# Altium project HAB_V01R01.PrjPCB (part 1 of 2)
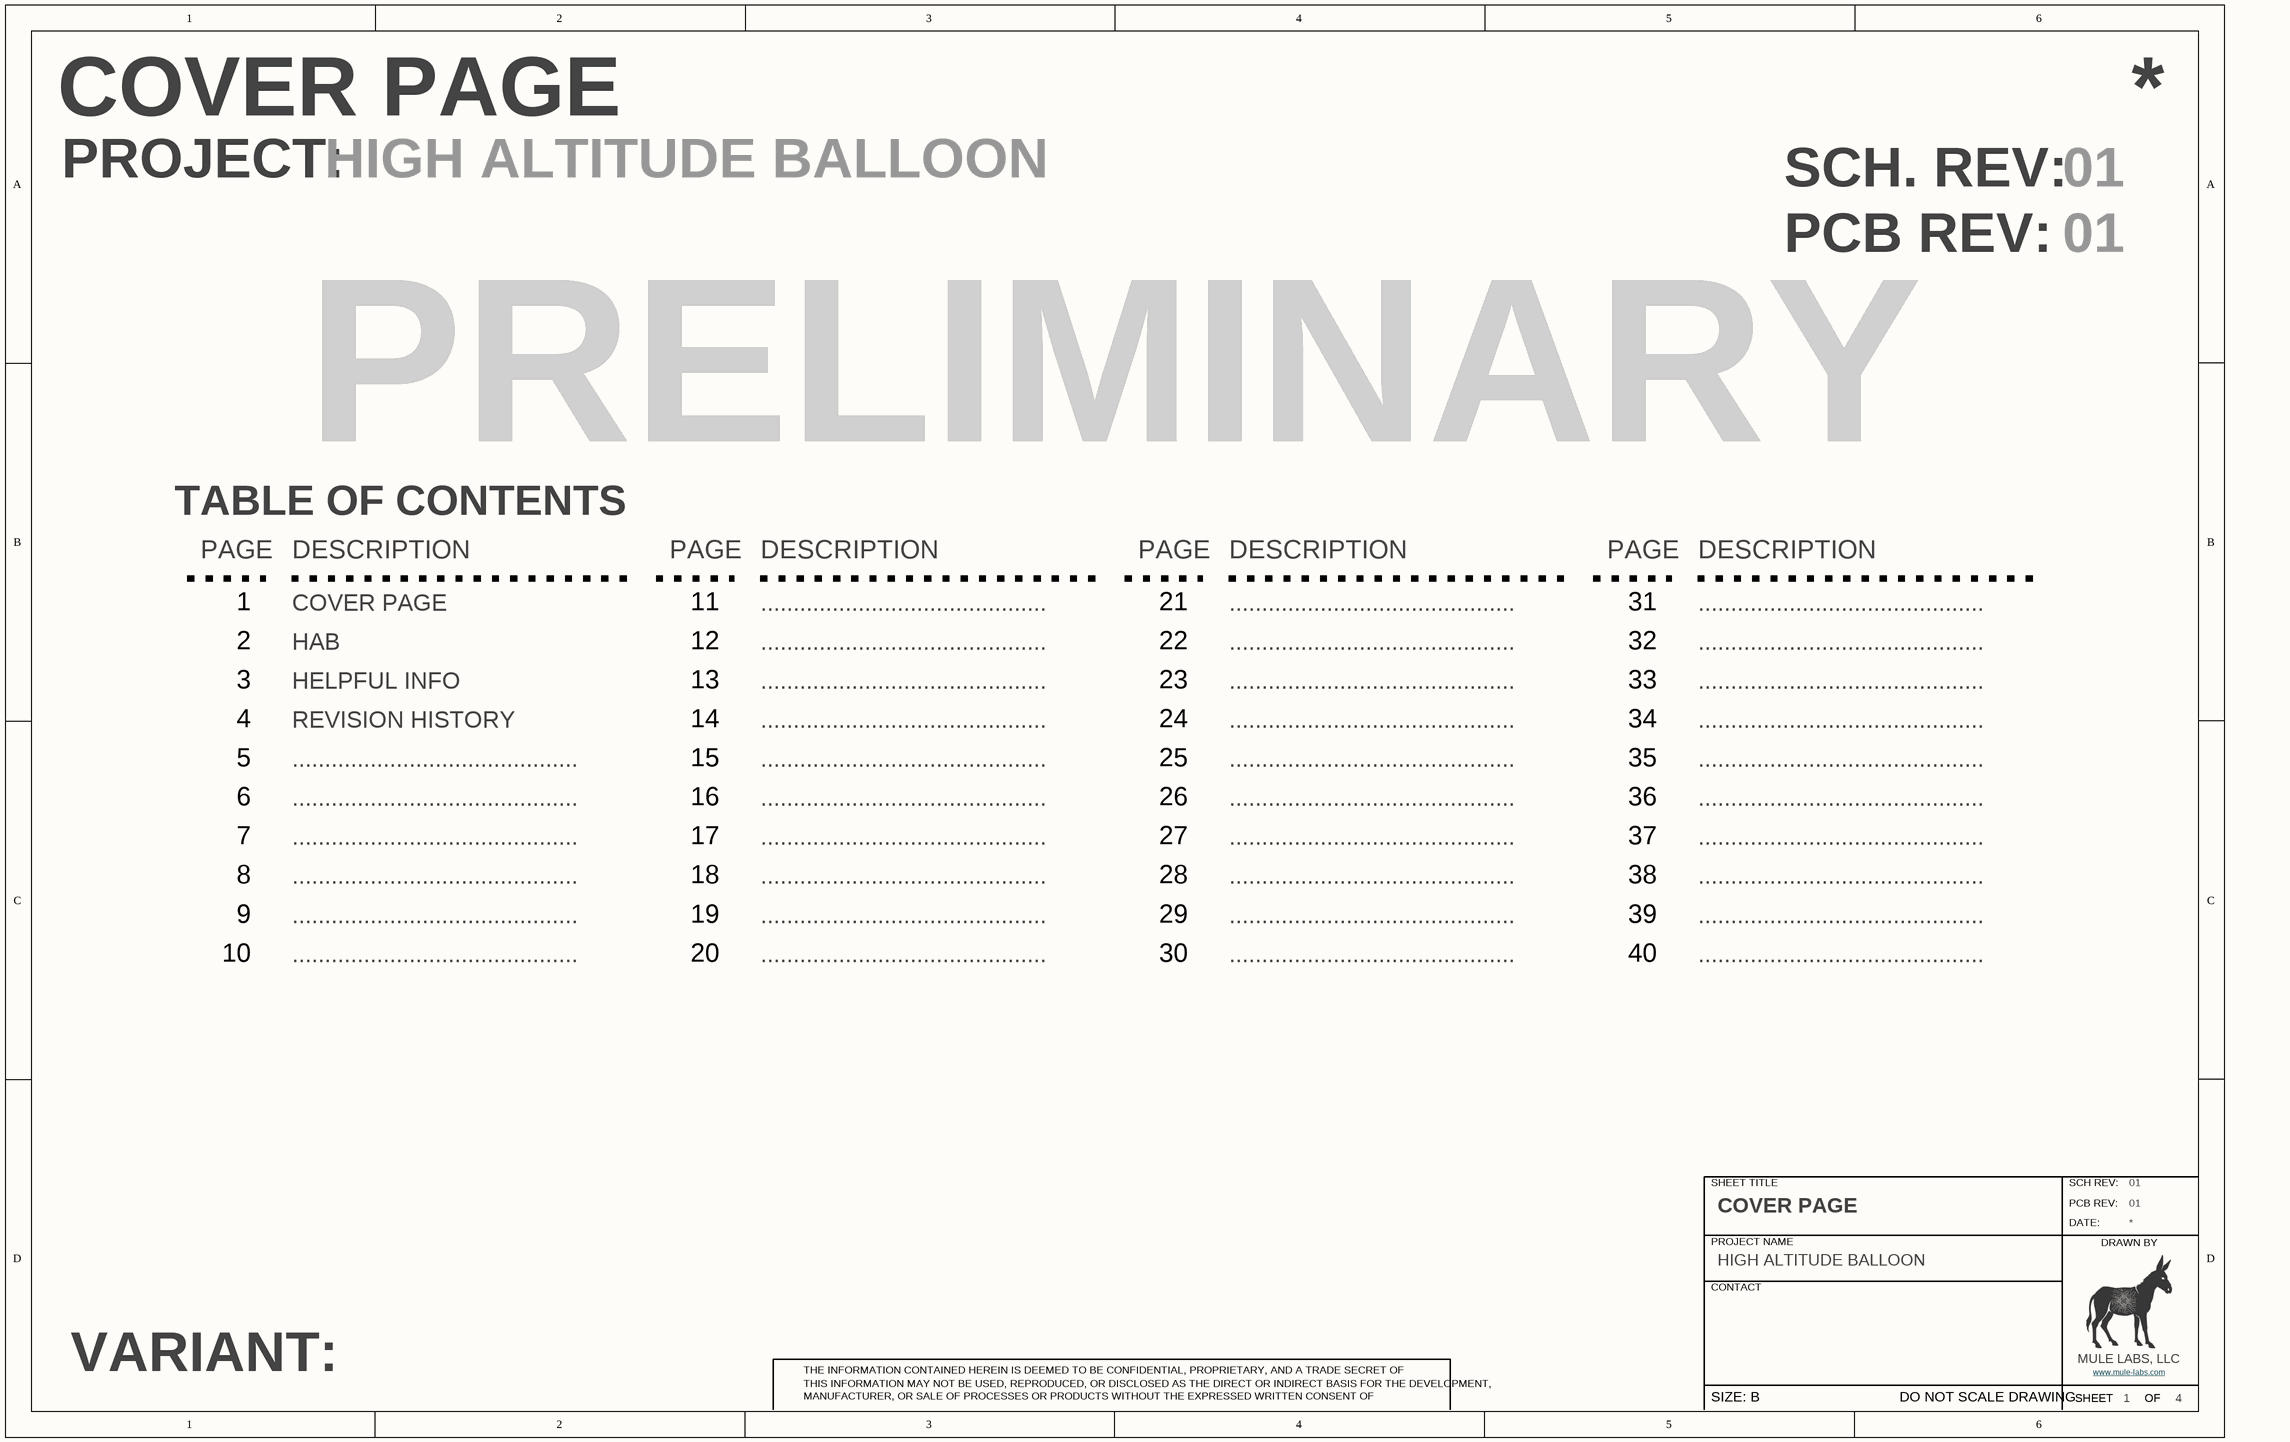
[diagram p0: [01] - COVER PAGE.SchDoc]
8 sheets, 74 parts. Net scope: global (net labels, ports and power ports of the same name join across sheets).
Board file: HAB_V01R01.PcbDoc
Sheets:
  [01] - COVER PAGE.SchDoc
  [02] - HAB.SchDoc
  [03] - HELPFUL INFO.SchDoc
  [04] - REVISION HISTORY.SchDoc
  [03] PWM DRIVER.SchDoc
  [04] POWER.SchDoc
  [05] SENSORS.SchDoc
  [06] Connectors.SchDoc

## Sheet [01] - COVER PAGE.SchDoc: COVER PAGE
size 433 x 279 mm; Author: ZAG; DrawnBy: ZAG; SheetNumber: 1; SheetTotal: 4; PageSetup: Record=PageOptions|CenterHorizontal=True|CenterVertical=True|PrintScale=0.96|XCorrection=1.00|YCorrection=1.00|PrintKind=2|BorderSize=5000000|LeftOffset=0|BottomOffset=0|Orientation=2|PaperLength=4318|PaperWidth=2794|Scale=100|PaperSource=15|PrintQuality=600|MediaType=1|DitherType=10|PaperKind=11x17|PrintScaleMode=1; SchRevision: 01; PCBRevision: 01; Project: HIGH ALTITUDE BALLOON; SchStatus: PRELIMINARY

### Notes on the sheet
- PROJECT:
- SCH. REV:
- PCB REV:
- TABLE OF CONTENTS
- PAGE
- 1
- DESCRIPTION
- COVER PAGE
- 11
- ............................................
- 21
- 31
- 2
- HAB
- 12
- 22
- 32
- 3
- 4
- REVISION HISTORY
- HELPFUL INFO
- 13
- 14
- 23
- 24
- 33
- 34
- 5
- 6
- 15
- 16
- 25
- 26
- 35
- 36
- 7
- 17
- 27
- 37
- 8
- 9
- 18
- 19
- 28
- 29
- 38
- 39
- 10
- 20
- 30
- 40
- VARIANT:
- SHEET TITLE
- SCH REV:
- PROJECT NAME
- DATE:
- DRAWN BY
- CONTACT
- MANUFACTURER, OR SALE OF PROCESSES OR PRODUCTS WITHOUT THE EXPRESSED WRITTEN CONSENT OF
- THE INFORMATION CONTAINED HEREIN IS DEEMED TO BE CONFIDENTIAL, PROPRIETARY, AND A TRADE SECRET OF
- THIS INFORMATION MAY NOT BE USED, REPRODUCED, OR DISCLOSED AS THE DIRECT OR INDIRECT BASIS FOR THE DEVELOPMENT,
- SHEET
- MULE LABS, LLC
- www.mule-labs.com <http://www.mule-labs.com>
- OF
- SIZE: B
- DO NOT SCALE DRAWING

## Sheet [02] - HAB.SchDoc: HAB
size 433 x 279 mm; Author: ZAG; DrawnBy: ZAG; SheetNumber: 2; SheetTotal: 4; PageSetup: Record=PageOptions|CenterHorizontal=True|CenterVertical=True|PrintScale=0.96|XCorrection=1.00|YCorrection=1.00|PrintKind=2|BorderSize=5000000|LeftOffset=0|BottomOffset=0|Orientation=2|PaperLength=4318|PaperWidth=2794|Scale=100|PaperSource=15|PrintQuality=600|MediaType=1|DitherType=10|PaperKind=11x17|PrintScaleMode=1; SchRevision: 01; PCBRevision: 01; Project: HIGH ALTITUDE BALLOON; SchStatus: PRELIMINARY
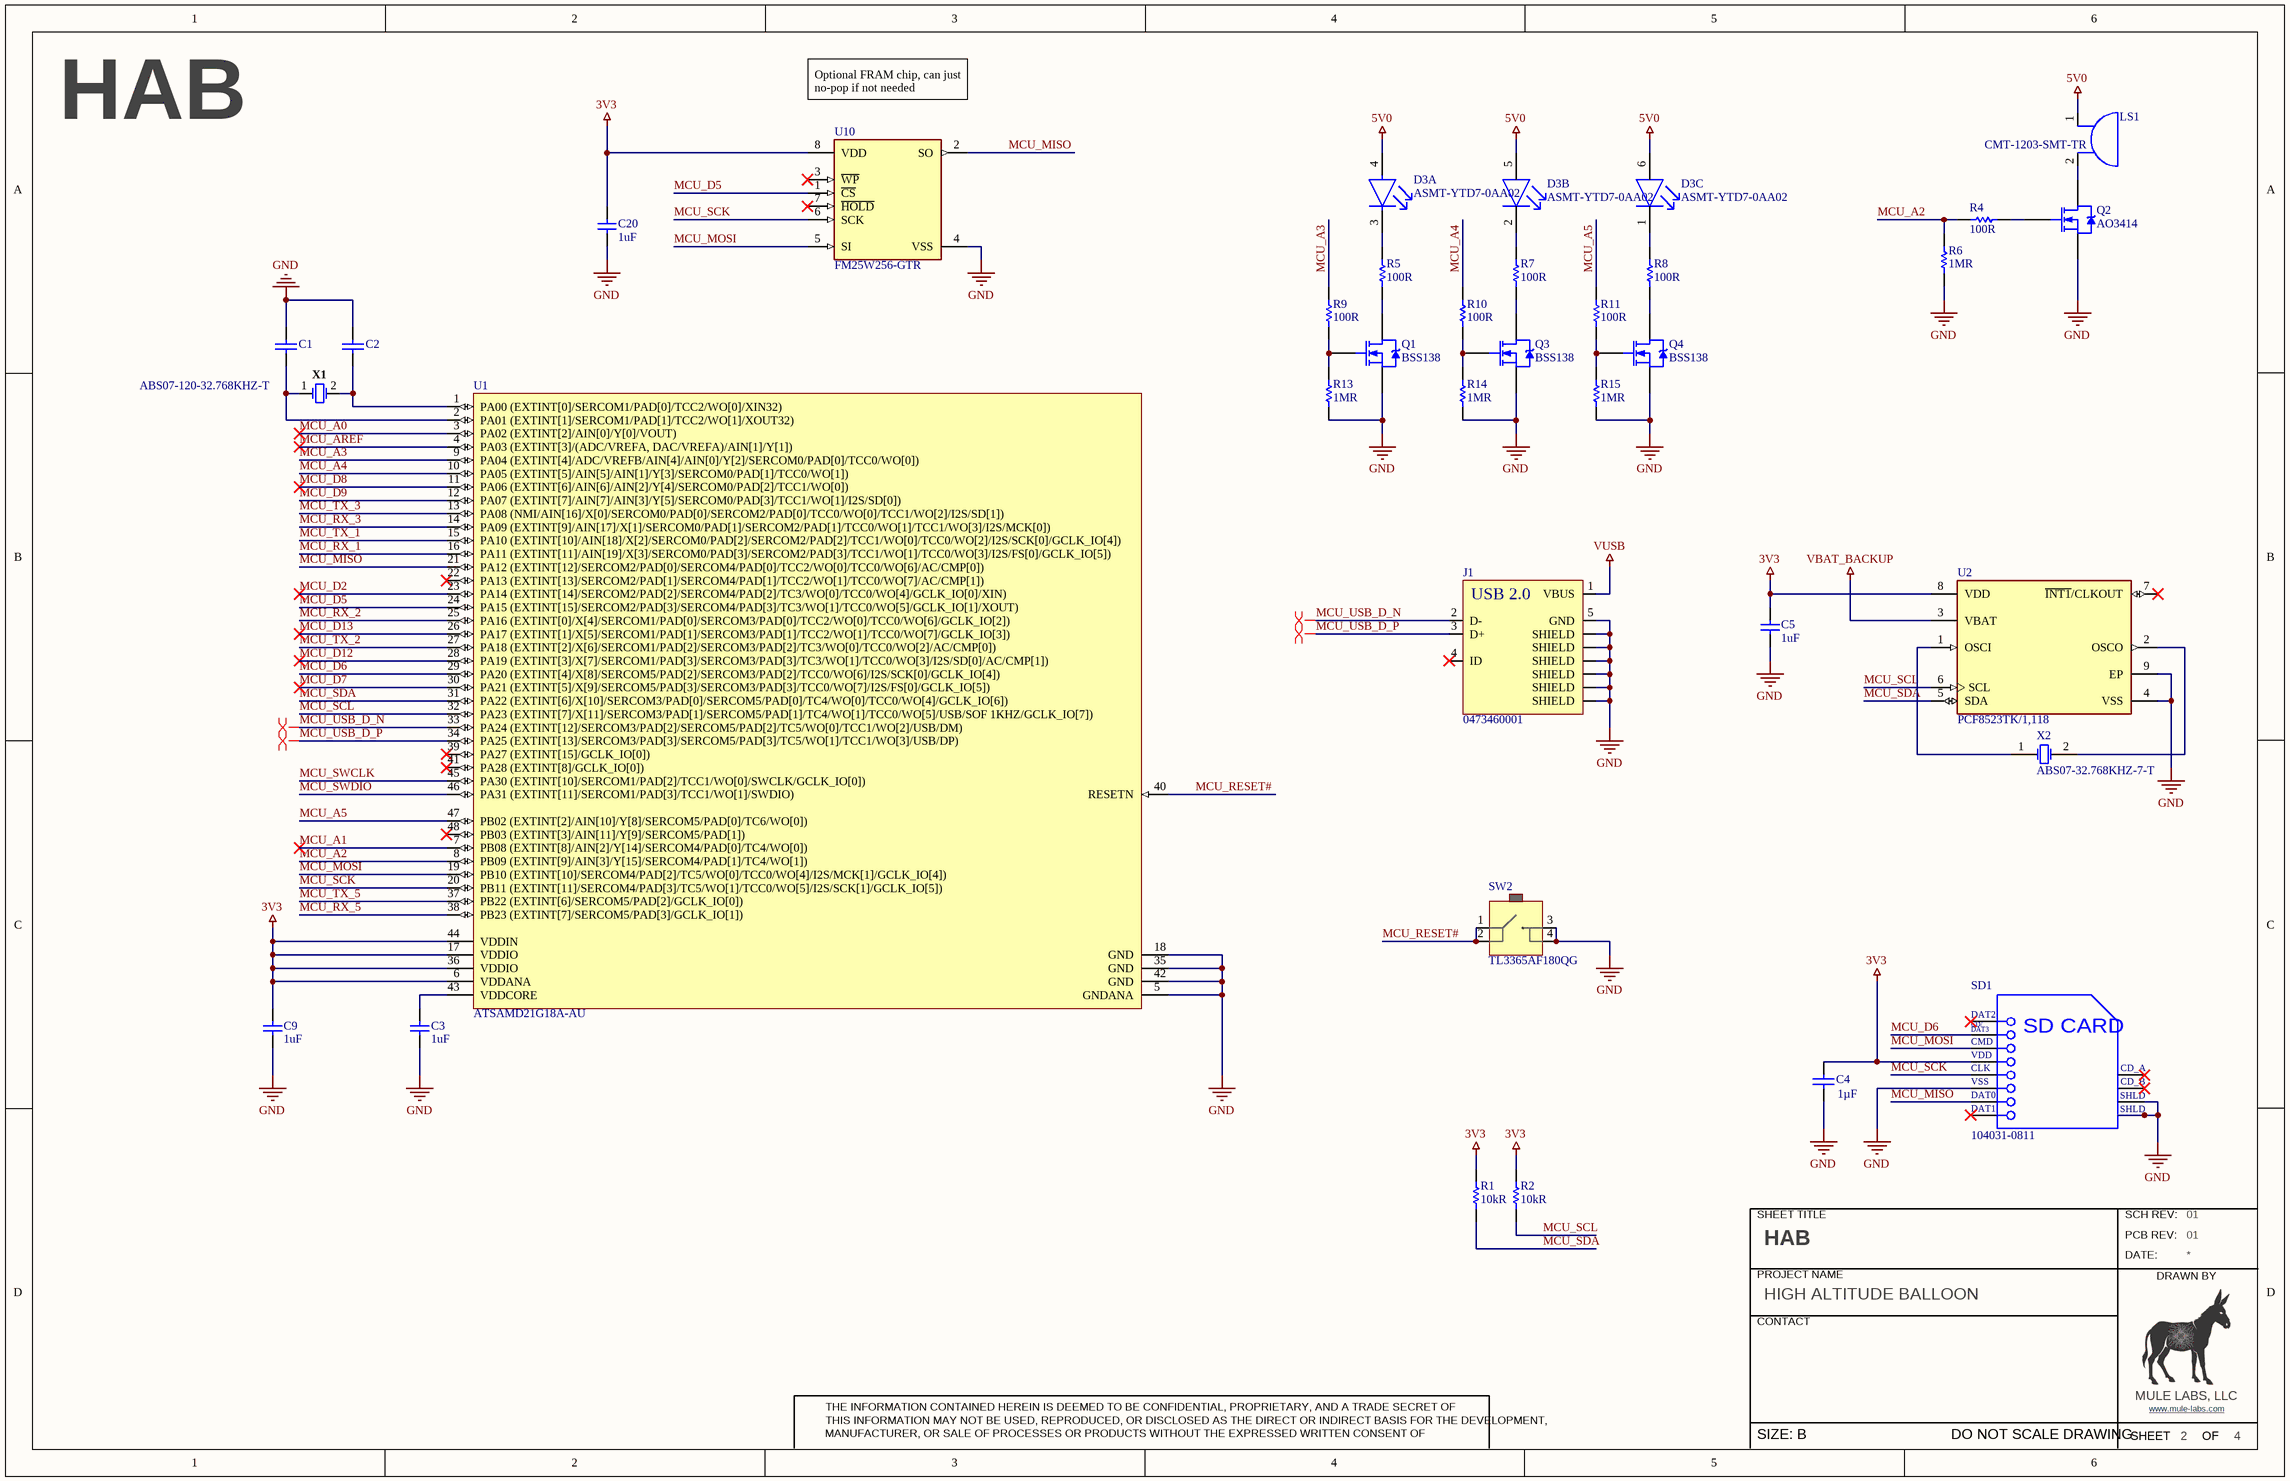
[diagram p1: [02] - HAB.SchDoc]

### Parts
C1  GRM21A5C2E220JW01D  [CAPC2013X100X30ML20]  (value not drawn)
C2  GRM21A5C2E220JW01D  [CAPC2013X100X30ML20]  (value not drawn)
C3  1uF  [INCH 0805 - METRIC 2012 - H140]
C4  Capacitance: 1µF  [CAPC2013X135X45ML10T25]  (hidden comment: GRM21BR71C105KA01L)
C5  1uF  [INCH 0805 - METRIC 2012 - H140]
C9  1uF  [INCH 0805 - METRIC 2012 - H140]
C20  1uF  [INCH 0805 - METRIC 2012 - H140]
D3  ASMT-YTD7-0AA02  [FP-PLCC-6-MFG]  (parts A,B,C of 3)
J1  0473460001  [MOLEX_047346-0001]
LS1  CMT-1203-SMT-TR  [CMT-1203-SMT-TR]
Q1  BSS138  [SOT95P240X120-3]
Q2  AO3414  [SOT95P240X120-3]
Q3  BSS138  [SOT95P240X120-3]
Q4  BSS138  [SOT95P240X120-3]
R1  10kR  [INCH 0805 - METRIC 2012 - H070]
R2  10kR  [INCH 0805 - METRIC 2012 - H070]
R4  100R  [INCH 0805 - METRIC 2012 - H070]
R5  100R  [INCH 0805 - METRIC 2012 - H070]
R6  1MR  [INCH 0805 - METRIC 2012 - H070]
R7  100R  [INCH 0805 - METRIC 2012 - H070]
R8  100R  [INCH 0805 - METRIC 2012 - H070]
R9  100R  [INCH 0805 - METRIC 2012 - H070]
R10  100R  [INCH 0805 - METRIC 2012 - H070]
R11  100R  [INCH 0805 - METRIC 2012 - H070]
R13  1MR  [INCH 0805 - METRIC 2012 - H070]
R14  1MR  [INCH 0805 - METRIC 2012 - H070]
R15  1MR  [INCH 0805 - METRIC 2012 - H070]
SD1  104031-0811  [MOLX-104031-0811_V]
SW2  TL3365AF180QG  [ESWITCH_TL3365AF180QG]
U1  ATSAMD21G18A-AU  [ATML-TQFP48_M]
U2  PCF8523TK/1,118  [FP-SOT909-1-MFG]
U10  FM25W256-GTR  [FP-51-85066-MFG]
X1  ABS07-120-32.768KHZ-T  [ABRA-ABS07_A_V]
X2  ABS07-32.768KHZ-7-T  [ABS07]

### Nets
3V3: C4.1 C5.2 C9.2 C20.2 R1.2 R2.2 SD1.4(VDD) U1.6(VDDANA) U1.17(VDDIO) U1.36(VDDIO) U1.44(VDDIN) U2.8(VDD) U10.8(VDD)
5V0: D3.4(Anode(Red)) D3.5(Anode(Green)) D3.6(Anode(Blue)) LS1.1
GND: C1.2 C2.2 C3.1 C4.2 C5.1 C9.1 C20.1 J1.0(SHIELD) J1.5(GND) Q1.2(S) Q2.2(S) Q3.2(S) Q4.2(S) R6.1 R13.1 R14.1 R15.1 SD1.6(VSS2) SD1.11(SHLD1) SD1.12(SHLD2) SW2.3 SW2.4 U1.5(GNDANA) U1.18(GND) U1.35(GND) U1.42(GND) U2.4(VSS) U2.9(EP) U10.4(VSS)
VBAT_BACKUP: U2.3(VBAT)
VUSB: J1.1(VBUS)
MCU_A0: U1.3(PA02_(EXTINT[2]/AIN[0]/Y[0]/VOUT))
MCU_A1: U1.7(PB08_(EXTINT[8]/AIN[2]/Y[14]/SERCOM4/PAD[0]/TC4/WO[0]))
MCU_A2: R4.1 R6.2 U1.8(PB09_(EXTINT[9]/AIN[3]/Y[15]/SERCOM4/PAD[1]/TC4/WO[1]))
MCU_A3: R9.2 U1.9(PA04_(EXTINT[4]/ADC/VREFB/AIN[4]/AIN[0]/Y[2]/SERCOM0/PAD[0]/TCC0/WO[0]))
MCU_A4: R10.2 U1.10(PA05_(EXTINT[5]/AIN[5]/AIN[1]/Y[3]/SERCOM0/PAD[1]/TCC0/WO[1]))
MCU_A5: R11.2 U1.47(PB02_(EXTINT[2]/AIN[10]/Y[8]/SERCOM5/PAD[0]/TC6/WO[0]))
MCU_AREF: U1.4(PA03_(EXTINT[3]/(ADC/VREFA,_DAC/VREFA)/AIN[1]/Y[1]))
MCU_D2: U1.23(PA14_(EXTINT[14]/SERCOM2/PAD[2]/SERCOM4/PAD[2]/TC3/WO[0]/TCC0/WO[4]/GCLK_IO[0]/XIN))
MCU_D5: U1.24(PA15_(EXTINT[15]/SERCOM2/PAD[3]/SERCOM4/PAD[3]/TC3/WO[1]/TCC0/WO[5]/GCLK_IO[1]/XOUT)) U10.1(~{CS})
MCU_D6: SD1.2(CMD) U1.29(PA20_(EXTINT[4]/X[8]/SERCOM5/PAD[2]/SERCOM3/PAD[2]/TCC0/WO[6]/I2S/SCK[0]/GCLK_IO[4]))
MCU_D7: U1.30(PA21_(EXTINT[5]/X[9]/SERCOM5/PAD[3]/SERCOM3/PAD[3]/TCC0/WO[7]/I2S/FS[0]/GCLK_IO[5]))
MCU_D8: U1.11(PA06_(EXTINT[6]/AIN[6]/AIN[2]/Y[4]/SERCOM0/PAD[2]/TCC1/WO[0]))
MCU_D9: U1.12(PA07_(EXTINT[7]/AIN[7]/AIN[3]/Y[5]/SERCOM0/PAD[3]/TCC1/WO[1]/I2S/SD[0]))
MCU_D12: U1.28(PA19_(EXTINT[3]/X[7]/SERCOM1/PAD[3]/SERCOM3/PAD[3]/TC3/WO[1]/TCC0/WO[3]/I2S/SD[0]/AC/CMP[1]))
MCU_D13: U1.26(PA17_(EXTINT[1]/X[5]/SERCOM1/PAD[1]/SERCOM3/PAD[1]/TCC2/WO[1]/TCC0/WO[7]/GCLK_IO[3]))
MCU_MISO: SD1.7(DAT0) U1.21(PA12_(EXTINT[12]/SERCOM2/PAD[0]/SERCOM4/PAD[0]/TCC2/WO[0]/TCC0/WO[6]/AC/CMP[0])) U10.2(SO)
MCU_MOSI: SD1.3(VSS1) U1.19(PB10_(EXTINT[10]/SERCOM4/PAD[2]/TC5/WO[0]/TCC0/WO[4]/I2S/MCK[1]/GCLK_IO[4])) U10.5(SI)
MCU_RESET#: SW2.1 SW2.2 U1.40(RESETN)
MCU_RX_1: U1.16(PA11_(EXTINT[11]/AIN[19]/X[3]/SERCOM0/PAD[3]/SERCOM2/PAD[3]/TCC1/WO[1]/TCC0/WO[3]/I2S/FS[0]/GCLK_IO[5]))
MCU_RX_2: U1.25(PA16_(EXTINT[0]/X[4]/SERCOM1/PAD[0]/SERCOM3/PAD[0]/TCC2/WO[0]/TCC0/WO[6]/GCLK_IO[2]))
MCU_RX_3: U1.14(PA09_(EXTINT[9]/AIN[17]/X[1]/SERCOM0/PAD[1]/SERCOM2/PAD[1]/TCC0/WO[1]/TCC1/WO[3]/I2S/MCK[0]))
MCU_RX_5: U1.38(PB23_(EXTINT[7]/SERCOM5/PAD[3]/GCLK_IO[1]))
MCU_SCK: SD1.5(CLK) U1.20(PB11_(EXTINT[11]/SERCOM4/PAD[3]/TC5/WO[1]/TCC0/WO[5]/I2S/SCK[1]/GCLK_IO[5])) U10.6(SCK)
MCU_SCL: R2.1 U1.32(PA23_(EXTINT[7]/X[11]/SERCOM3/PAD[1]/SERCOM5/PAD[1]/TC4/WO[1]/TCC0/WO[5]/USB/SOF_1KHZ/GCLK_IO[7])) U2.6(SCL)
MCU_SDA: R1.1 U1.31(PA22_(EXTINT[6]/X[10]/SERCOM3/PAD[0]/SERCOM5/PAD[0]/TC4/WO[0]/TCC0/WO[4]/GCLK_IO[6])) U2.5(SDA)
MCU_SWCLK: U1.45(PA30_(EXTINT[10]/SERCOM1/PAD[2]/TCC1/WO[0]/SWCLK/GCLK_IO[0]))
MCU_SWDIO: U1.46(PA31_(EXTINT[11]/SERCOM1/PAD[3]/TCC1/WO[1]/SWDIO))
MCU_TX_1: U1.15(PA10_(EXTINT[10]/AIN[18]/X[2]/SERCOM0/PAD[2]/SERCOM2/PAD[2]/TCC1/WO[0]/TCC0/WO[2]/I2S/SCK[0]/GCLK_IO[4]))
MCU_TX_2: U1.27(PA18_(EXTINT[2]/X[6]/SERCOM1/PAD[2]/SERCOM3/PAD[2]/TC3/WO[0]/TCC0/WO[2]/AC/CMP[0]))
MCU_TX_3: U1.13(PA08_(NMI/AIN[16]/X[0]/SERCOM0/PAD[0]/SERCOM2/PAD[0]/TCC0/WO[0]/TCC1/WO[2]/I2S/SD[1]))
MCU_TX_5: U1.37(PB22_(EXTINT[6]/SERCOM5/PAD[2]/GCLK_IO[0]))
MCU_USB_D_N: J1.2(D-) U1.33(PA24_(EXTINT[12]/SERCOM3/PAD[2]/SERCOM5/PAD[2]/TC5/WO[0]/TCC1/WO[2]/USB/DM))
MCU_USB_D_P: J1.3(D+) U1.34(PA25_(EXTINT[13]/SERCOM3/PAD[3]/SERCOM5/PAD[3]/TC5/WO[1]/TCC1/WO[3]/USB/DP))
NetC1_1: C1.1 U1.2(PA01_(EXTINT[1]/SERCOM1/PAD[1]/TCC2/WO[1]/XOUT32)) X1.1
NetC2_1: C2.1 U1.1(PA00_(EXTINT[0]/SERCOM1/PAD[0]/TCC2/WO[0]/XIN32)) X1.2
NetC3_2: C3.2 U1.43(VDDCORE)
NetD3_1: D3.1(Cathode(Blue)) R8.2
NetD3_2: D3.2(Cathode(Green)) R7.2
NetD3_3: D3.3(Cathode(Red)) R5.2
NetLS1_2: LS1.2 Q2.3(D)
NetQ1_1: Q1.1(G) R9.1 R13.2
NetQ1_3: Q1.3(D) R5.1
NetQ2_1: Q2.1(G) R4.2
NetQ3_1: Q3.1(G) R10.1 R14.2
NetQ3_3: Q3.3(D) R7.1
NetQ4_1: Q4.1(G) R11.1 R15.2
NetQ4_3: Q4.3(D) R8.1
NetU2_1: U2.1(OSCI) X2.1(OSC1)
NetU2_2: U2.2(OSCO) X2.2(OSC2)

Not connected (* = marked no-connect by the designer): J1 4(ID)*; SD1 1(CD/DAT3)* 8(DAT1)* 9(CD_A)* 10(CD_B)*; U1 22(PA13_(EXTINT[13]/SERCOM2/PAD[1]/SERCOM4/PAD[1]/TCC2/WO[1]/TCC0/WO[7]/AC/CMP[1]))* 39(PA27_(EXTINT[15]/GCLK_IO[0]))* 41(PA28_(EXTINT[8]/GCLK_IO[0]))* 48(PB03_(EXTINT[3]/AIN[11]/Y[9]/SERCOM5/PAD[1]))*; U2 7(~{INT1}/CLKOUT)*; U10 3(~{WP})* 7(~{HOLD})*

### Layout directives
differential pair: MCU_USB_D_N, MCU_USB_D_P

### Notes on the sheet
- Optional FRAM chip, can just no-pop if not needed
- SHEET TITLE
- SCH REV:
- PROJECT NAME
- PCB REV:
- DATE:
- DRAWN BY
- CONTACT
- MANUFACTURER, OR SALE OF PROCESSES OR PRODUCTS WITHOUT THE EXPRESSED WRITTEN CONSENT OF
- THE INFORMATION CONTAINED HEREIN IS DEEMED TO BE CONFIDENTIAL, PROPRIETARY, AND A TRADE SECRET OF
- THIS INFORMATION MAY NOT BE USED, REPRODUCED, OR DISCLOSED AS THE DIRECT OR INDIRECT BASIS FOR THE DEVELOPMENT,
- SHEET
- MULE LABS, LLC
- www.mule-labs.com <http://www.mule-labs.com>
- OF
- SIZE: B
- DO NOT SCALE DRAWING
- (in symbol 0473460001) USB 2.0
- (in symbol CMP-2000-05825-1) DAT2; CD/; DAT3; SD CARD; VSS; SHLD

### Library data of the parts
C1 C2 = CMP-2007-03977-1: Manufacturer: Murata; Part Number: GRM21A5C2E220JW01D
C3 C5 C9 C20 = GCM21BR71E105KA56L: CAP SMD 1uF 25V 10% 0805; Manufacturer: Murata; Dielectric: X7R; Supplier 1: Digi-Key; Manufacturer Part Number: GCM21BR71E105KA56L; RoHS: Yes; Category: Ceramic Capacitors; Stock 1: 1572955; Pricing 1: 1=0.33000, 10=0.22500, 100=0.12760, 500=0.09004, 1000=0.07878 (USD); Mount: Surface Mount; Case/Package: 0805; Case Code (Metric): 2012; Case Code (Imperial): 0805; Min Operating Temperature: -55°C; Max Operating Temperature: 125°C; Termination: SMD/SMT; Voltage: 25V; Package Quantity: 3000; Capacitance: 1uF; Voltage Rating: 25V; Tolerance: 10%; Packaging: Tape and Reel; Voltage Rating (DC): 25V; Length: 2mm; Height: 1.25mm; Thickness: 0.055inch; Depth: 1.25mm; Width: 0.049inch; Ratings: AEC-Q200; Radiation Hardening: No; REACH SVHC: No SVHC; Lead Free: Lead Free; ComponentLink1URL: https://datasheet.ciiva.com/3778/359gcm21br71e105ka5623-3778560.pdf?src-supplier=Arrow; ComponentLink1Description: https://datasheet.ciiva.com/3778/359gcm21br71e105ka5623-3778560.pdf?src-supplier=Arrow; ComponentLink2URL: https://datasheet.ciiva.com/16624/product-16624576.pdf?src-supplier=Avnet+Europe; ComponentLink2Description: https://datasheet.ciiva.com/16624/product-16624576.pdf?src-supplier=Avnet+Europe; ComponentLink3URL: https://datasheet.ciiva.com/18183/getdatasheetpartid-153106-18183696.pdf?src-supplier=Verical; ComponentLink3Description: https://datasheet.ciiva.com/18183/getdatasheetpartid-153106-18183696.pdf?src-supplier=Verical; ComponentLink4URL: https://datasheet.ciiva.com/11789/0900766b80ef92d0-11789092.pdf?src-supplier=RSComponents; ComponentLink4Description: https://datasheet.ciiva.com/11789/0900766b80ef92d0-11789092.pdf?src-supplier=RSComponents; ComponentLink5URL: https://datasheet.ciiva.com/137/product-137199.pdf?src-supplier=Digi-Key; ComponentLink5Description: https://datasheet.ciiva.com/137/product-137199.pdf?src-supplier=Digi-Key; ComponentLink6URL: https://datasheet.ciiva.com/137/product-137200.pdf?src-supplier=Digi-Key; ComponentLink6Description: https://datasheet.ciiva.com/137/product-137200.pdf?src-supplier=Digi-Key; ComponentLink7URL: https://datasheet.ciiva.com/137/product-137201.pdf?src-supplier=Digi-Key; ComponentLink7Description: https://datasheet.ciiva.com/137/product-137201.pdf?src-supplier=Digi-Key; ComponentLink8URL: https://datasheet.ciiva.com/2989/product-2989245.pdf?src-supplier=Avnet; ComponentLink8Description: https://datasheet.ciiva.com/2989/product-2989245.pdf?src-supplier=Avnet; ComponentLink9URL: https://datasheet.ciiva.com/2989/product-2989246.pdf?src-supplier=Avnet; ComponentLink9Description: https://datasheet.ciiva.com/2989/product-2989246.pdf?src-supplier=Avnet; Supplier Part Number 1: 490-4785-1-ND
C4 = CMP-2000-04946-1: Multilayer Ceramic Capacitor, 1 uF, +/- 10%, 16 V, -55 to 125 degC, 0805 (2012 Metric), RoHS, Tape and Reel; Manufacturer: Murata; Dielectric: X7R; Rated Voltage: 16V; Package Description: 2-Pin Surface Mount Device, Body 2 x 1.25 mm; Datasheet Version: Mar-08; Package Reference: 805; Datasheet URL: https://datasheet.ciiva.com/34302/1858922-34302874.pdf; Case Size/Dimension: 0805; Tolerance (%): ±10%; Manufacturer URL: http://www.murata.com/
D3 = CMP-18399-000005-1: LED RGB DIFFUSED 6PLCC SMD; Manufacturer: Broadcom; Power Dissipation: 125/90/90mW; Colour: Red, Green, Blue; Led Orientation: Top View; Max Junction Temp: +110°C; Forward Current: 20mA; Wavelength: 623/529/469nm; Description: Red, Green, Blue (RGB) 623nm Red, 529nm Green, 469nm Blue LED Indication - Discrete 2.1V Red, 3.1V Green, 3.1V Blue 6-SMD, J-Lead; Viewing Angle: 120°; Forward Voltage: 2.1/3.1/3.1V; Reverse Voltage: 4V; Luminous Intensity: 650/1900/384mcd; Peak Emmision Wavelength: 630/522/465nm; Height: 2mm; Temperature: -40°C to +100°C; ComponentLink2URL: https://docs.broadcom.com/doc/AV02-3873EN; Temperature Range High: +100°C; RoHS: TRUE; Device Class L3: unset; ComponentLink2Description: Datasheet; Automotive: No; Temperature Range Low: -40°C; Device Class L1: Optoelectronics; Manufacturer Part Number: ASMT-YTD7-0AA02; Octopart: https://octopart.com/asmt-ytd7-0aa02-broadcom-71127359; Category: Diode; Package: PLCC-6; Lead Free: Yes; Device Class L2: LEDs; Digikey Description: LED RGB DIFFUSED 6PLCC SMD; Mouser Description: Standard LEDs - SMD PLCC6,T/MT SILICONE RGB
J1 = 0473460001: Conn Micro USB Type B RCP 5 POS 0.65mm Solder RA SMD 5 Terminal 1 Port Embossed T/R; Manufacturer: Molex; Number of Contacts: 5; Gender: Receptacle; Number of Ports: 1; Max Voltage Rating (AC): 30V; Supplier 1: Digi-Key; Manufacturer Part Number: 0473460001; Stock 1: 27309; Pricing 1: 1=1, 10=0.877, 25=0.8252, 50=0.7906, 100=0.7563, 250=0.68752, 500=0.61876, 1000=0.55 (USD); Mount: Surface Mount,Horizontal; Contact Material: Copper Alloy; Contact Plating: Nickel,Gold; Housing Material: Polymer; Number of Terminals: 5; Min Operating Temperature: -30°C; Max Operating Temperature: 85°C; Packaging: Tape and Reel; Orientation: Right Angle; Package Quantity: 1; Termination: Solder; Connector Type: USB; Length: 7.8mm; Pitch: 0.65mm; Depth: 5.43mm; Radiation Hardening: No; ComponentLink1URL: https://datasheet.ciiva.com/6731/473460001-sd-6731041.pdf; ComponentLink1Description: https://datasheet.ciiva.com/6731/473460001-sd-6731041.pdf; ComponentLink2URL: https://datasheet.ciiva.com/16545/0473460001-io-connectors-16545778.pdf; ComponentLink2Description: https://datasheet.ciiva.com/16545/0473460001-io-connectors-16545778.pdf; ComponentLink3URL: https://datasheet.ciiva.com/3094/0473460001-io-connectors-3094381.pdf; ComponentLink3Description: https://datasheet.ciiva.com/3094/0473460001-io-connectors-3094381.pdf; Supplier Part Number 1: WM17141CT-ND; Category: Connector
LS1 = CMT-1203-SMT-TR: AUDIO PIEZO TRANSDUCER 25V SMD; Manufacturer: CUI; Frequency: 4kHz; Voltage Rating: 5V; Operating Supply Current: 5mA; Supplier 1: Digi-Key; Manufacturer Part Number: CMT-1203-SMT-TR; RoHS: Yes; Category: Audio Products; Stock 1: 22304; Pricing 1: 1=1.99000, 10=1.64900, 25=1.52400, 50=1.43320, 100=1.34560, 500=1.15502 (USD); Mount: Surface Mount; Case/Package: SMD/SMT; Min Operating Temperature: -40°C; Max Operating Temperature: 120°C; Package Quantity: 1000; Packaging: Tape and Reel; Termination: Solder; Length: 12mm; Height: 3.3mm; Width: 12mm; Lead Free: Lead Free; ComponentLink1URL: http://www.mouser.com/ds/2/670/cmt-1203-smt-515906.pdf?src-supplier=Mouser; ComponentLink1Description: http://www.mouser.com/ds/2/670/cmt-1203-smt-515906.pdf?src-supplier=Mouser; ComponentLink2URL: https://www.cui.com/product/resource/digikeypdf/cmt-1203-smt.pdf?src-supplier=Digi-Key; ComponentLink2Description: https://www.cui.com/product/resource/digikeypdf/cmt-1203-smt.pdf?src-supplier=Digi-Key; Supplier Part Number 1: 102-2197-1-ND
Q1 Q3 Q4 = BSS138: MOSFET N-CH 50V 220MA SOT-23; Manufacturer: ON Semiconductor / Fairchild; Rds On Max: 3.5R; Input Capacitance: 27pF; Max Power Dissipation: 360mW; Turn-Off Delay Time: 20ns; Turn-On Delay Time: 2.5ns; Gate to Source Voltage (Vgs): 20V; Number of Elements: 1; Threshold Voltage: 1.3V; Element Configuration: Single; On-State Resistance: 6R; Rise Time: 9ns; Supplier 1: Digi-Key; Manufacturer Part Number: BSS138; Stock 1: 1717197; Pricing 1: 1=0.32, 10=0.292, 100=0.1633, 500=0.0875, 1000=0.0595 (USD); Mount: Surface Mount; Case/Package: SOT-23; Number of Pins: 3; Weight: 0.03g; Contact Plating: Tin,Matte; Min Operating Temperature: -55°C; Max Operating Temperature: 150°C; Packaging: Tape and Reel; Continuous Drain Current (ID): 220mA; Power Dissipation: 360mW; Package Quantity: 1; Drain to Source Voltage (Vdss): 50V; Drain to Source Breakdown Voltage: 50V; Drain to Source Resistance: 3.5R; Nominal Vgs: 1.3V; Voltage Rating (DC): 50V; Current Rating: 220mA; Fall Time: 9ns; Dual Supply Voltage: 50V; Termination: SMD/SMT; Length: 2.92mm; Height: 0.93mm; Width: 1.3mm; Radiation Hardening: No; REACH SVHC: No SVHC; Lead Free: Lead Free; ComponentLink1URL: https://datasheet.ciiva.com/931/bss138-931776.pdf; ComponentLink1Description: https://datasheet.ciiva.com/931/bss138-931776.pdf; ComponentLink2URL: https://datasheet.ciiva.com/1190/193736-1190130.pdf; ComponentLink2Description: https://datasheet.ciiva.com/1190/193736-1190130.pdf; ComponentLink3URL: https://datasheet.ciiva.com/1190/193736-1190131.pdf; ComponentLink3Description: https://datasheet.ciiva.com/1190/193736-1190131.pdf; ComponentLink4URL: https://datasheet.ciiva.com/1254/193736-1254983.pdf; ComponentLink4Description: https://datasheet.ciiva.com/1254/193736-1254983.pdf; ComponentLink5URL: https://datasheet.ciiva.com/3304/bss138-3304423.pdf; ComponentLink5Description: https://datasheet.ciiva.com/3304/bss138-3304423.pdf; ComponentLink6URL: https://datasheet.ciiva.com/3304/bss138-3304424.pdf; ComponentLink6Description: https://datasheet.ciiva.com/3304/bss138-3304424.pdf; ComponentLink7URL: https://datasheet.ciiva.com/22655/193736-22655240.pdf; ComponentLink7Description: https://datasheet.ciiva.com/22655/193736-22655240.pdf; ComponentLink8URL: https://datasheet.ciiva.com/16834/bss138-16834843.pdf; ComponentLink8Description: https://datasheet.ciiva.com/16834/bss138-16834843.pdf; ComponentLink9URL: https://datasheet.ciiva.com/27050/784896-27050043.pdf; ComponentLink9Description: https://datasheet.ciiva.com/27050/784896-27050043.pdf; ComponentLink10URL: https://datasheet.ciiva.com/26229/bss138-26229007.pdf; ComponentLink10Description: https://datasheet.ciiva.com/26229/bss138-26229007.pdf; Supplier Part Number 1: BSS138CT-ND; Category: Transistor
Q2 = AO3414: MOSFET N-CH 20V 4.2A SOT23; Manufacturer: Alpha & Omega Semiconductor; Rds On Max: 50mR; Input Capacitance: 436pF; Continuous Drain Current (ID): 3A; Max Power Dissipation: 1.4W; Number of Elements: 1; Gate to Source Voltage (Vgs): 8V; Supplier 1: Digi-Key; Manufacturer Part Number: AO3414; Stock 1: 451497; Pricing 1: 1=0.5, 10=0.357, 100=0.2102, 500=0.11896, 1000=0.09121 (USD); Mount: Surface Mount; Case/Package: SOT-23; Number of Pins: 3; Min Operating Temperature: -55°C; Max Operating Temperature: 150°C; Packaging: Tape and Reel; Drain to Source Voltage (Vdss): 20V; Power Dissipation: 1.4W; Radiation Hardening: No; Lead Free: Lead Free; ComponentLink1URL: http://aosmd.com/res/packaging_information/SOT-23-3L.pdf; ComponentLink1Description: http://aosmd.com/res/packaging_information/SOT-23-3L.pdf; ComponentLink2URL: https://www.verical.com/server-webapp/html/getDatasheet?partID=64433; ComponentLink2Description: https://www.verical.com/server-webapp/html/getDatasheet?partID=64433; Supplier Part Number 1: 785-1009-1-ND
R1 R2 = ERJ-P06F1002V: RES SMD 10kOHM 1% 1/2W 0805; Manufacturer: Panasonic; Power Rating: 500mW; Voltage Rating: 150V; Temperature Coefficient: 100ppm/°C; Supplier 1: Digi-Key; Manufacturer Part Number: ERJ-P06F1002V; RoHS: Yes; Category: Chip SMD Resistors; Stock 1: 119213; Pricing 1: 1=0.17000, 10=0.14800, 100=0.05770, 1000=0.02416, 2500=0.02214 (USD); Mount: Surface Mount; Case/Package: 0805; Case Code (Imperial): 0805; Case Code (Metric): 2012; Contact Plating: Tin; Min Operating Temperature: -55°C; Max Operating Temperature: 155°C; Resistance: 10kR; Packaging: Tape and Reel; Tolerance: 1%; Package Quantity: 5000; Termination: SMD/SMT; Military Standard: Not; Voltage Rating (DC): 150V; Composition: Thick Film; Length: 2mm; Height: 0.6mm; Width: 1.2mm; Depth: 1.25mm; Radiation Hardening: No; REACH SVHC: No SVHC; Lead Free: Lead Free; ComponentLink1URL: https://datasheet.ciiva.com/11811/0900766b812cb812-11811124.pdf?src-supplier=RSComponents; ComponentLink1Description: https://datasheet.ciiva.com/11811/0900766b812cb812-11811124.pdf?src-supplier=RSComponents; ComponentLink2URL: https://datasheet.ciiva.com/24069/aoa0000ce4-64075-24069191.pdf?src-supplier=Mouser; ComponentLink2Description: https://datasheet.ciiva.com/24069/aoa0000ce4-64075-24069191.pdf?src-supplier=Mouser; ComponentLink3URL: https://datasheet.ciiva.com/48426/erjp-series-eng-tds-48426779.pdf?src-supplier=Distrelec; ComponentLink3Description: https://datasheet.ciiva.com/48426/erjp-series-eng-tds-48426779.pdf?src-supplier=Distrelec; Supplier Part Number 1: P16059CT-ND
R4 R5 R7-R11 = ERJ-P06J101V: RES SMD 100 OHM 5% 1/2W 0805; Manufacturer: Panasonic; Temperature Coefficient: 200ppm/°C; Power Rating: 500mW; Voltage Rating: 400V; Voltage Rating (DC): 150V; Supplier 1: Digi-Key; Manufacturer Part Number: ERJ-P06J101V; RoHS: Yes; Category: Chip SMD Resistors; Stock 1: 141947; Pricing 1: 1=0.11000, 10=0.10300, 100=0.03960, 1000=0.01742, 2500=0.01505 (USD); Mount: Surface Mount; Case/Package: 0805; Weight: 0.000194oz; Contact Plating: Tin; Case Code (Imperial): 0805; Case Code (Metric): 2012; Min Operating Temperature: -55°C; Max Operating Temperature: 155°C; Resistance: 100R; Tolerance: 5%; Composition: Thick Film; Packaging: Tape and Reel; Package Quantity: 1; Max Power Dissipation: 500mW; Number of Terminations: 2; Military Standard: Not; Termination: SMD/SMT; Features: Automotive AEC-Q200; Length: 2mm; Height: 0.6mm; Width: 1.2mm; Depth: 1.25mm; Lead Free: Lead Free; REACH SVHC: Unknown; ComponentLink1URL: https://datasheet.ciiva.com/11810/0900766b812cb812-11810156.pdf?src-supplier=RSComponents; ComponentLink1Description: https://datasheet.ciiva.com/11810/0900766b812cb812-11810156.pdf?src-supplier=RSComponents; ComponentLink2URL: https://datasheet.ciiva.com/16788/70068906-16788678.pdf?src-supplier=Allied+Electronics; ComponentLink2Description: https://datasheet.ciiva.com/16788/70068906-16788678.pdf?src-supplier=Allied+Electronics; ComponentLink3URL: https://datasheet.ciiva.com/7831/aoa0000ce4-7831000.pdf?src-supplier=Element14; ComponentLink3Description: https://datasheet.ciiva.com/7831/aoa0000ce4-7831000.pdf?src-supplier=Element14; ComponentLink4URL: https://datasheet.ciiva.com/16767/70068906-16767564.pdf?src-supplier=Allied+Electronics; ComponentLink4Description: https://datasheet.ciiva.com/16767/70068906-16767564.pdf?src-supplier=Allied+Electronics; ComponentLink5URL: https://datasheet.ciiva.com/9186/aoa0000ce4-9186844.pdf?src-supplier=Avnet; ComponentLink5Description: https://datasheet.ciiva.com/9186/aoa0000ce4-9186844.pdf?src-supplier=Avnet; ComponentLink6URL: https://datasheet.ciiva.com/24163/aoa0000ce4-64075-24163318.pdf?src-supplier=Mouser; ComponentLink6Description: https://datasheet.ciiva.com/24163/aoa0000ce4-64075-24163318.pdf?src-supplier=Mouser; ComponentLink7URL: https://datasheet.ciiva.com/17208/aoa0000ce4-17208010.pdf?src-supplier=Avnet+Europe; ComponentLink7Description: https://datasheet.ciiva.com/17208/aoa0000ce4-17208010.pdf?src-supplier=Avnet+Europe; Supplier Part Number 1: P100ADCT-ND
R6 R13-R15 = ERJ-P06J105V: Res Thick Film 0805 1M Ohm 5% 1/4W 200ppm/C Molded SMD SMD Punched Carrier T/R; Manufacturer: Panasonic; Temperature Coefficient: 200ppm/°C; Voltage Rating (DC): 150V; Max Power Dissipation: 500mW; Voltage Rating: 400V; Supplier 1: Digi-Key; Manufacturer Part Number: ERJ-P06J105V; RoHS: Yes; Category: Chip SMD Resistors; Stock 1: 44455; Pricing 1: 1=0.11000, 10=0.10300, 100=0.03960, 1000=0.01742, 2500=0.01505 (USD); Mount: Surface Mount; Case/Package: 0805; Contact Plating: Tin; Case Code (Metric): 2012; Case Code (Imperial): 0805; Min Operating Temperature: -55°C; Max Operating Temperature: 155°C; Composition: Thick Film; Resistance: 1MR; Tolerance: 5%; Number of Terminations: 2; Military Standard: Not; Termination: SMD/SMT; Power Rating: 500mW; Features: Automotive AEC-Q200; Packaging: Tape and Reel; Package Quantity: 1; Length: 2mm; Height: 0.6mm; Depth: 1.25mm; Width: 0.049inch; Radiation Hardening: No; REACH SVHC: Unknown; Lead Free: Lead Free; ComponentLink1URL: https://datasheet.ciiva.com/11815/0900766b812cb812-11815881.pdf?src-supplier=RSComponents; ComponentLink1Description: https://datasheet.ciiva.com/11815/0900766b812cb812-11815881.pdf?src-supplier=RSComponents; ComponentLink2URL: https://datasheet.ciiva.com/16781/70068906-16781958.pdf?src-supplier=Allied+Electronics; ComponentLink2Description: https://datasheet.ciiva.com/16781/70068906-16781958.pdf?src-supplier=Allied+Electronics; ComponentLink3URL: https://datasheet.ciiva.com/16782/70068906-16782920.pdf?src-supplier=Allied+Electronics; ComponentLink3Description: https://datasheet.ciiva.com/16782/70068906-16782920.pdf?src-supplier=Allied+Electronics; ComponentLink4URL: https://datasheet.ciiva.com/16785/70068906-16785434.pdf?src-supplier=Allied+Electronics; ComponentLink4Description: https://datasheet.ciiva.com/16785/70068906-16785434.pdf?src-supplier=Allied+Electronics; ComponentLink5URL: https://datasheet.ciiva.com/7909/1913273-7909563.pdf?src-supplier=Element14; ComponentLink5Description: https://datasheet.ciiva.com/7909/1913273-7909563.pdf?src-supplier=Element14; ComponentLink6URL: https://datasheet.ciiva.com/24044/aoa0000ce4-64075-24044221.pdf?src-supplier=Mouser; ComponentLink6Description: https://datasheet.ciiva.com/24044/aoa0000ce4-64075-24044221.pdf?src-supplier=Mouser; ComponentLink7URL: https://datasheet.ciiva.com/17215/aoa0000ce4-17215262.pdf?src-supplier=Avnet+Europe; ComponentLink7Description: https://datasheet.ciiva.com/17215/aoa0000ce4-17215262.pdf?src-supplier=Avnet+Europe; Supplier Part Number 1: P1.0MADCT-ND
SD1 = CMP-2000-05825-1: Micro SD Card, RA, -25 to 85 degC, 8-Pin SMD, RoHS, Tape and Reel; Voltage Rating: 10VAC/DC; Number of Contacts: 8; Insertion - Extraction Style: Push-Pull; Pitch: 1.1mm; Mating Cycles: 10000; Brand: Molex; Current Rating: 500mA; Manufacturer URL: http://www.molex.com/; Card Type: microSD; Mounting Type: Standard; Height: 1.42mm; Mounting Technology: SurfaceMount; Contact Plating: Gold; Product Category: MemoryCardConnectors; Package Description: 8-Pin Surface Mount Device, Body 11.95 x 11.4 mm, Pitch 1.1 mm; Datasheet URL: http://www.molex.com/pdm_docs/sd/1040310811_sd.pdf; Termination Style: SMD; Length: 11.4mm; Housing Material: LiquidCrystalPolymer(LCP); Orientation: RightAngle; RoHS: True; Contact Material: PhosphorBronze; Datasheet Version: Rev. E, 04/2006; Packaging: Reel; Manufacturer: Molex; Series: 104031; Product: CardConnectors; Number of Rows: 1Row; Package Reference: 104031-0811
SW2 = TL3365AF180QG: SWITCH TACTILE SPST-NO 0.05A 12V; Manufacturer: E-Switch; Mechanical Life: 100000Cycles; Illumination Type: Non-Illuminated; Operating Force: 180gf; Throw Configuration: SPST; Switch Travel: 0.2mm; Switch Function: Off-Mom; Supplier 1: Digi-Key; Manufacturer Part Number: TL3365AF180QG; Stock 1: 55347; Pricing 1: 1=0.34, 10=0.333, 25=0.3208, 50=0.3088, 100=0.297, 250=0.27324, 500=0.2376, 1000=0.20196 (USD); Mount: Surface Mount; Min Operating Temperature: -20°C; Max Operating Temperature: 70°C; Packaging: Tape and Reel; Termination: Gull Wing; Lead Free: Lead Free; Supplier Part Number 1: EG5384CT-ND
U1 = CMP-2100-03585-1: SMART ARM-Based Microcontroller, 1.62 to 3.63 V, 256 KB Flash, 32 KB SRAM, -40 to 85 degC, 48-Pin TQFP, RoHS, Tray; Manufacturer: Atmel; Max Frequency: 48MHz; Number of Timers/Counters: 6; Max Supply Voltage: 3.63V; Min Supply Voltage: 1.62V; Packaging: Tray; Datasheet Version: Rev. N, 10/2016; Datasheet URL: http://www.atmel.com/images/atmel-42181-sam-d21_datasheet.pdf; REACH SVHC: NoSVHC; RoHSCompliant: true; Max Operating Temperature: 85degC; Manufacturer URL: http://www.atmel.com/; Contact Plating: Tin; Frequency: 48MHz; Package Description: 48-Pin Thin Profile Plastic Quad Flat Package, Body 7 x 7 mm, Pitch 0.5 mm; Package Reference: TQFP48; Lead Free: LeadFree; Number of Pins: 48; Min Operating Temperature: -40degC; Case/Package: TQFP; Mount: SurfaceMount
U2 = CMP-10083-000004-1: IC RTC CLK/CALENDAR I2C 8-HVSON; Manufacturer: NXP Semiconductors; Standoff Height: 0mm; Nominal Supply Current: 0.15-1.2uA; Number Of Outputs: 1; Min Supply Voltage: 1V; Max Supply Voltage: 5.5V; Category: IC; Ipc Land Pattern Name: DFN400X400X100-8; Manufacturer Part Number: PCF8523TK/1,118; Temperature Range Low: -40°C; Automotive: No; Package: SOT909-1; Height: 1mm; Ambient Temperature Range High: +85°C; Digikey Description: IC RTC CLK/CALENDAR I2C 8-HVSON; Device Class L3: Real Time Clocks; Device Class L1: Integrated Circuits (ICs); Temperature Range High: +85°C; Device Class L2: Clock and Timing; Ambient Temperature Range Low: -40°C; Interface: I2C; Temperature: -40°C to +85°C; ComponentLink2Description: Datasheet; Octopart: https://octopart.com/pcf8523tk%2F1%2C118-nxp+semiconductors-19647992; Mouser Description: Real Time Clock REAL-TIME CLOCK (RTC) AND CALENDAR; Footprint Url: https://www.nxp.com/docs/en/package-information/SOT909-1.pdf; RoHS: TRUE; ComponentLink2URL: https://www.nxp.com/docs/en/data-sheet/PCF8523.pdf; Lead Free: Yes
U10 = CMP-12945-000012-1: IC FRAM 256K SPI 20MHZ 8SOIC; Manufacturer: Cypress Semiconductor; Min Supply Voltage: 2.7V; Max Supply Voltage: 5.5V; Nominal Supply Current: 0.25-2mA; Standoff Height: 0.1mm; Memory Type: OTHER; Memory Size: 256Kbits; Device Class L2: Memory; Height: 1.727mm; Frequency: 20MHz; Ipc Land Pattern Name: SOIC127P602X164-8; Category: IC; Lead Free: Yes; Manufacturer Part Number: FM25W256-GTR; Package: 51-85066; Ambient Temperature Range Low: -40°C; Temperature Range Low: -40°C; RoHS: TRUE; Ambient Temperature Range High: +85°C; Interface: SPI; ComponentLink2Description: Datasheet; Octopart: https://octopart.com/fm25w256-gtr-cypress+semiconductor-25384375; Device Class L1: Integrated Circuits (ICs); Automotive: No; Temperature: -40°C to +85°C; Device Class L3: unset; Temperature Range High: +85°C; Mouser Description: F-RAM SPI FRAM 256k 3-5V; Footprint Url: https://www.cypress.com/file/42881/download; Digikey Description: IC FRAM 256K SPI 20MHZ 8SOIC; ComponentLink2URL: https://www.cypress.com/file/41696/download
X1 = CMP-2000-07587-1: Tuning Fork Crystal, 32.768 KHz, +/- 20 ppm, -40 to 85 degC, 2-Pin SMD, RoHS, Tape and Reel; Manufacturer: Abracon; Case\/Package: SMD/SMT; Series Resistance: 60KOhm; Frequency Tolerance: 20ppm; Load Capacitance: 6pF; ESR (Equivalent Series Resistance): 55KOhm; Max Operating Temperature: 85degC; Width: 0.061inch; Radiation Hardening: No; Lead Free: LeadFree; RoHSCompliant: True; Depth: 1.5mm; Datasheet URL: http://www.abracon.com/Resonators/ABS07-120-32.768kHz-T.pdf; Frequency: 32.768KHz; Termination: SMD/SMT; Manufacturer URL: http://www.abracon.com/; Package Quantity: 3000; Packaging: TapeandReel; Number of Pins: 2; Height: 0.035inch; Package Description: 2-Pin Surface Mount Device, Body 3.2 x 1.5 mm; Package Reference: ABS07; Mount: SurfaceMount; Tolerance: 20ppm; Mounting Technology: SurfaceMount; REACH SVHC: NoSVHC; Datasheet Version: 11/2014; Length: 3.2mm; Min Operating Temperature: -40degC
X2 = ABS07-32.768KHZ-7-T: In a Pack of 10, Abracon 32.768kHz Crystal Unit ±20ppm SMD 2-Pin 3.2 x 1.5 x 0.9mm; Insulation Resistance: 500MR; Load Capacitance: 7pF; ESR (Equivalent Series Resistance): 70kR; Supplier 1: Digi-Key; Manufacturer: Abracon; Manufacturer Part Number: ABS07-32.768KHZ-7-T; RoHS: Yes; Category: Crystals; Stock 1: 166337; Pricing 1: 1=1.09000, 10=0.96100, 50=0.89880, 100=0.79420, 500=0.75240, 1000=0.62700 (USD); Mount: Surface Mount; Case/Package: CSMD; Number of Pins: 2; Min Operating Temperature: -40°C; Max Operating Temperature: 85°C; Packaging: Tape and Reel; Frequency Tolerance: 20ppm; Frequency: 32.768kHz; Package Quantity: 3000; Tolerance: 20ppm; Frequency Stability: 20ppm; Termination: SMD/SMT; Series Resistance: 70kR; Length: 3.2mm; Height: 0.035inch; Width: 1.5mm; Depth: 1.5mm; Radiation Hardening: No; Lead Free: Lead Free; REACH SVHC: No SVHC; ComponentLink1URL: https://datasheet.ciiva.com/3174/abs07-3174144.pdf?src-supplier=Avnet; ComponentLink1Description: https://datasheet.ciiva.com/3174/abs07-3174144.pdf?src-supplier=Avnet; ComponentLink2URL: https://datasheet.ciiva.com/855/abs07-855947.pdf?src-supplier=Digi-Key; ComponentLink2Description: https://datasheet.ciiva.com/855/abs07-855947.pdf?src-supplier=Digi-Key; ComponentLink3URL: https://datasheet.ciiva.com/16199/abs07-16199467.pdf?src-supplier=Future+Electronics; ComponentLink3Description: https://datasheet.ciiva.com/16199/abs07-16199467.pdf?src-supplier=Future+Electronics; ComponentLink4URL: https://datasheet.ciiva.com/8344/abs07-8344589.pdf?src-supplier=Avnet; ComponentLink4Description: https://datasheet.ciiva.com/8344/abs07-8344589.pdf?src-supplier=Avnet; ComponentLink5URL: https://datasheet.ciiva.com/855/abs07-855945.pdf?src-supplier=Digi-Key; ComponentLink5Description: https://datasheet.ciiva.com/855/abs07-855945.pdf?src-supplier=Digi-Key; ComponentLink6URL: https://datasheet.ciiva.com/855/abs07-855946.pdf?src-supplier=Digi-Key; ComponentLink6Description: https://datasheet.ciiva.com/855/abs07-855946.pdf?src-supplier=Digi-Key; Supplier Part Number 1: 535-9543-1-ND

## Sheet [03] - HELPFUL INFO.SchDoc: HELPFUL INFO
size 433 x 279 mm; Author: ZAG; DrawnBy: ZAG; SheetNumber: 3; SheetTotal: 4; PageSetup: Record=PageOptions|CenterHorizontal=True|CenterVertical=True|PrintScale=0.96|XCorrection=1.00|YCorrection=1.00|PrintKind=2|BorderSize=5000000|LeftOffset=0|BottomOffset=0|Orientation=2|PaperLength=4318|PaperWidth=2794|Scale=100|PaperSource=15|PrintQuality=600|MediaType=1|DitherType=10|PaperKind=11x17|PrintScaleMode=1; PCBRevision: 01; SchRevision: 01; Project: HIGH ALTITUDE BALLOON; SchStatus: PRELIMINARY
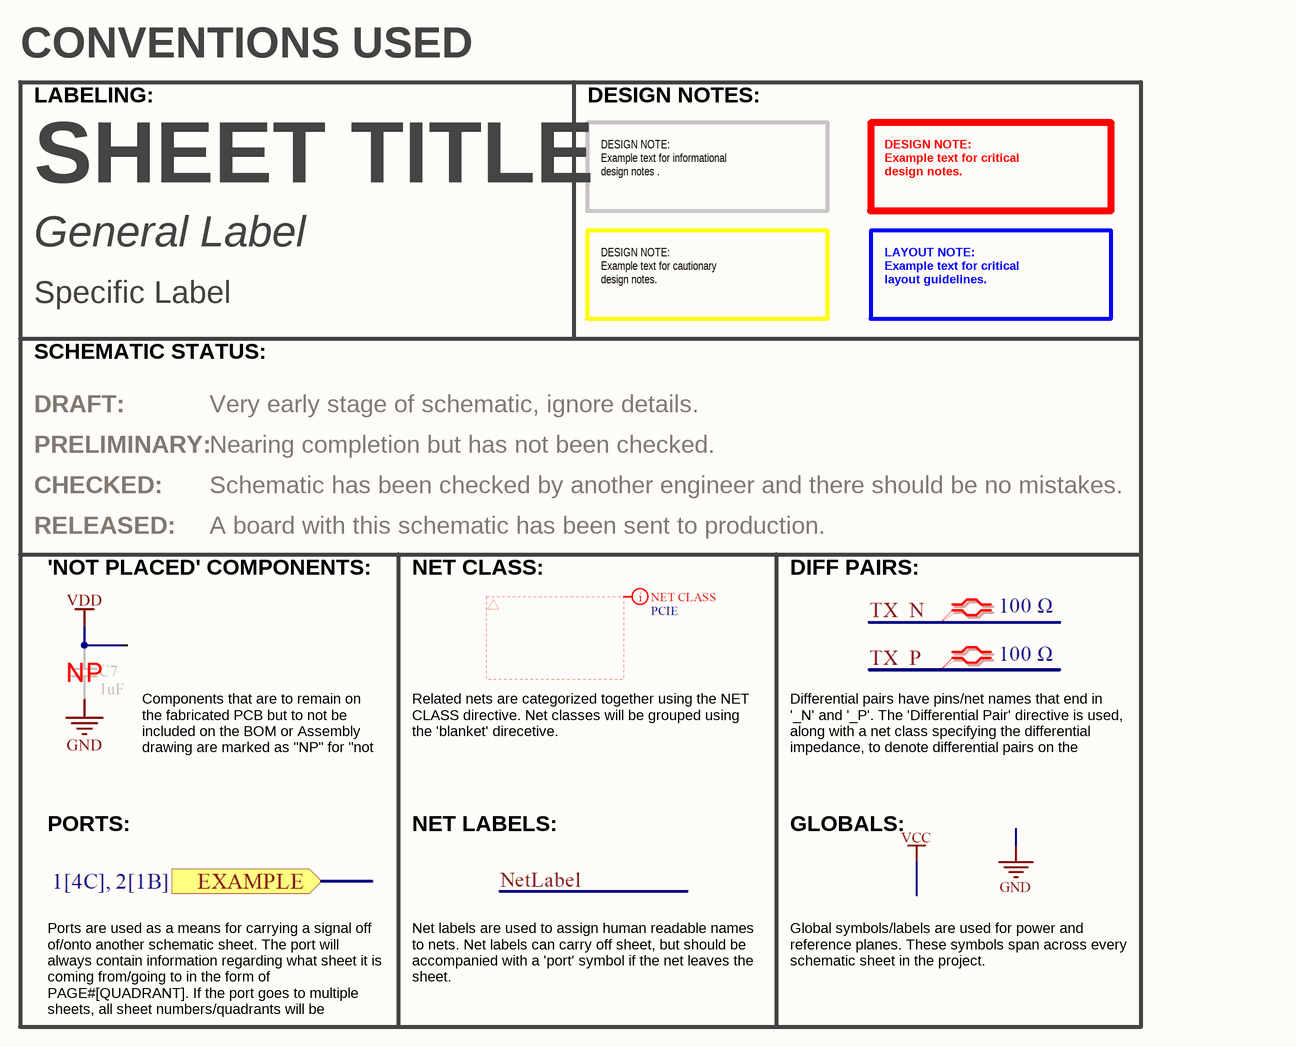
[diagram p2: [03] - HELPFUL INFO.SchDoc]

### Notes on the sheet
- CONVENTIONS USED
- LABELING:
- DESIGN NOTES:
- SHEET TITLE
- DESIGN NOTE:
  Example text for informational
  design notes .
- DESIGN NOTE:
  Example text for critical
  design notes.
- General Label
- Specific Label
- DESIGN NOTE:
  Example text for cautionary
  design notes.
- LAYOUT NOTE:
  Example text for critical
  layout guidelines.
- SCHEMATIC STATUS:
- PRELIMINARY:
- DRAFT:
- Very early stage of schematic, ignore details.
- Nearing completion but has not been checked.
- RELEASED:
- CHECKED:
- Schematic has been checked by another engineer and there should be no mistakes.
- A board with this schematic has been sent to production.
- 'NOT PLACED' COMPONENTS:
- NET CLASS:
- DIFF PAIRS:
- Related nets are categorized together using the NET CLASS directive. Net classes will be grouped using the 'blanket' direcetive.
- Components that are to remain on the fabricated PCB but to not be included on the BOM or Assembly drawing are marked as "NP" for "not placed".
- Differential pairs have pins/net names that end in '_N' and '_P'. The 'Differential Pair' directive is used, along with a net class specifying the differential impedance, to denote differential pairs on the schematic.
- PORTS:
- NET LABELS:
- GLOBALS:
- Ports are used as a means for carrying a signal off of/onto another schematic sheet. The port will always contain information regarding what sheet it is coming from/going to in the form of PAGE#[QUADRANT]. If the port goes to multiple sheets, all sheet numbers/quadrants will be displayed next to the port.
- Net labels are used to assign human readable names to nets. Net labels can carry off sheet, but should be accompanied with a 'port' symbol if the net leaves the sheet.
- Global symbols/labels are used for power and reference planes. These symbols span across every schematic sheet in the project.
- SCH REV:
- PROJECT NAME
- PCB REV:
- DATE:
- DRAWN BY
- CONTACT
- MANUFACTURER, OR SALE OF PROCESSES OR PRODUCTS WITHOUT THE EXPRESSED WRITTEN CONSENT OF
- THE INFORMATION CONTAINED HEREIN IS DEEMED TO BE CONFIDENTIAL, PROPRIETARY, AND A TRADE SECRET OF
- THIS INFORMATION MAY NOT BE USED, REPRODUCED, OR DISCLOSED AS THE DIRECT OR INDIRECT BASIS FOR THE DEVELOPMENT,
- SHEET
- MULE LABS, LLC
- www.mule-labs.com <http://www.mule-labs.com>
- OF
- SIZE: B
- DO NOT SCALE DRAWING

## Sheet [04] - REVISION HISTORY.SchDoc: REVISION HISTORY
size 433 x 279 mm; Author: ZAG; DrawnBy: ZAG; SheetNumber: 4; SheetTotal: 4; PageSetup: Record=PageOptions|CenterHorizontal=True|CenterVertical=True|PrintScale=0.96|XCorrection=1.00|YCorrection=1.00|PrintKind=2|BorderSize=5000000|LeftOffset=0|BottomOffset=0|Orientation=2|PaperLength=4318|PaperWidth=2794|Scale=100|PaperSource=15|PrintQuality=600|MediaType=1|DitherType=10|PaperKind=11x17|PrintScaleMode=1; SchRevision: 01; PCBRevision: 01; Project: HIGH ALTITUDE BALLOON; SchStatus: PRELIMINARY
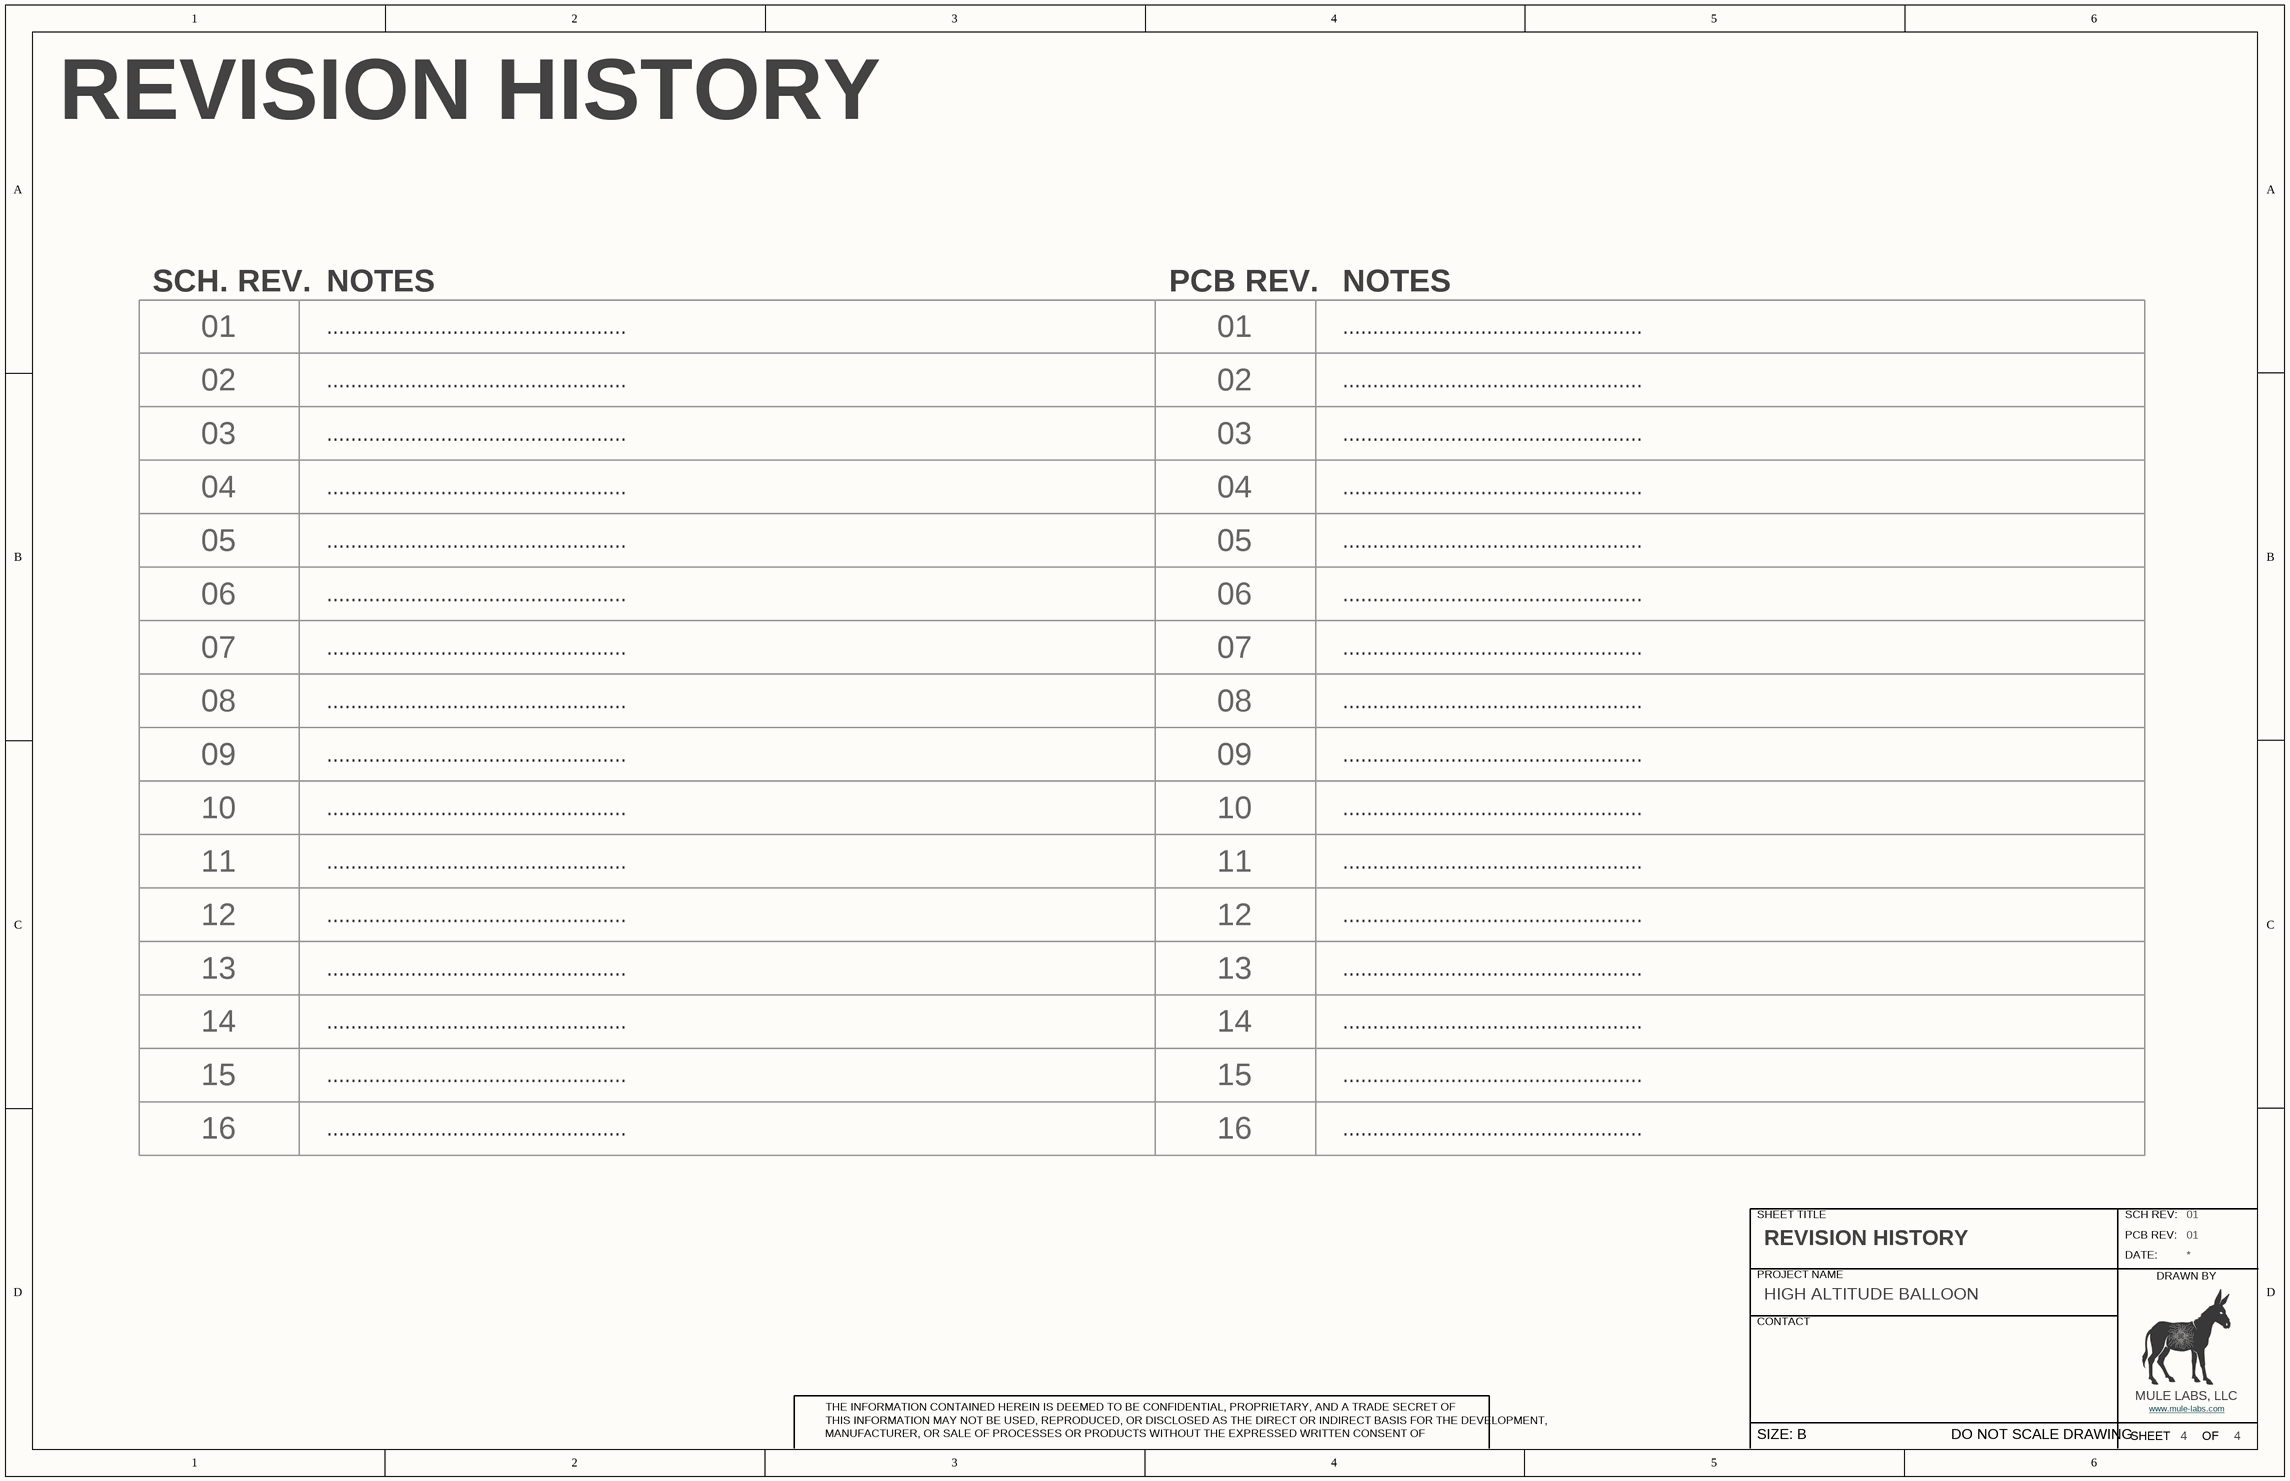
[diagram p3: [04] - REVISION HISTORY.SchDoc]

### Notes on the sheet
- SCH. REV.
- NOTES
- PCB REV.
- 01
- ..................................................
- 02
- 03
- 04
- 05
- 06
- 07
- 08
- 09
- 10
- 11
- 12
- 13
- 14
- 15
- 16
- SHEET TITLE
- SCH REV:
- PROJECT NAME
- PCB REV:
- DATE:
- DRAWN BY
- CONTACT
- MANUFACTURER, OR SALE OF PROCESSES OR PRODUCTS WITHOUT THE EXPRESSED WRITTEN CONSENT OF
- THE INFORMATION CONTAINED HEREIN IS DEEMED TO BE CONFIDENTIAL, PROPRIETARY, AND A TRADE SECRET OF
- THIS INFORMATION MAY NOT BE USED, REPRODUCED, OR DISCLOSED AS THE DIRECT OR INDIRECT BASIS FOR THE DEVELOPMENT,
- SHEET
- MULE LABS, LLC
- www.mule-labs.com <http://www.mule-labs.com>
- OF
- SIZE: B
- DO NOT SCALE DRAWING

## Sheet [03] PWM DRIVER.SchDoc
size A
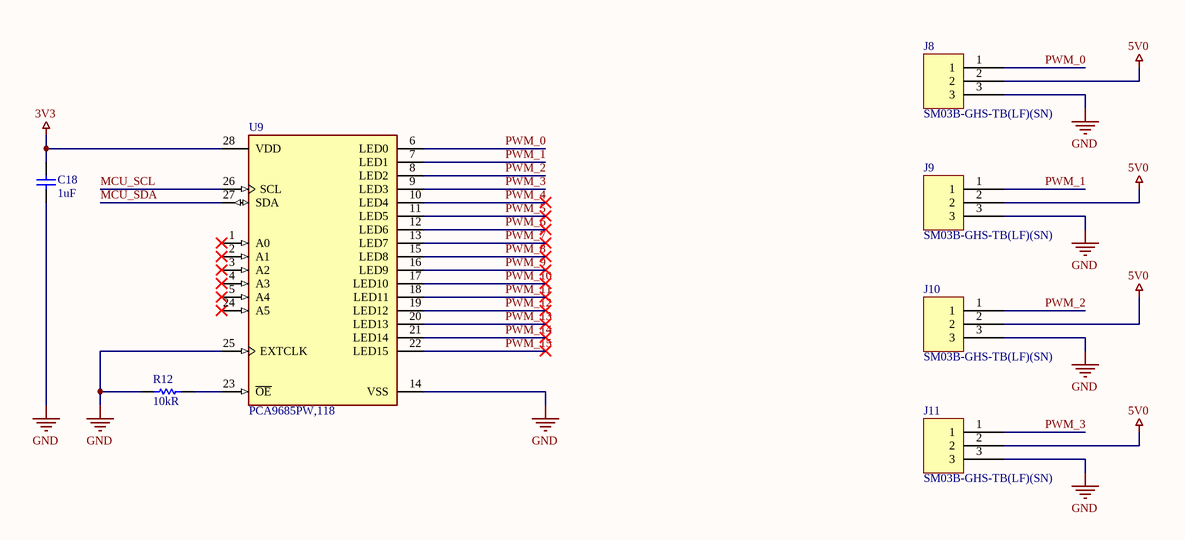
[diagram p4: [03] PWM DRIVER.SchDoc]

### Parts
C18  1uF  [INCH 0805 - METRIC 2012 - H140]
J8  SM03B-GHS-TB(LF)(SN)  [SM03B-GHS-TB(LF)(SN)]
J9  SM03B-GHS-TB(LF)(SN)  [SM03B-GHS-TB(LF)(SN)]
J10  SM03B-GHS-TB(LF)(SN)  [SM03B-GHS-TB(LF)(SN)]
J11  SM03B-GHS-TB(LF)(SN)  [SM03B-GHS-TB(LF)(SN)]
R12  10kR  [INCH 0805 - METRIC 2012 - H070]
U9  PCA9685PW,118  [FP-SOT361-1-MFG]

### Nets
3V3: C18.2 U9.28(VDD)
5V0: J8.2 J9.2 J10.2 J11.2
GND: C18.1 J8.3 J9.3 J10.3 J11.3 R12.2 U9.14(VSS) U9.25(EXTCLK)
MCU_SCL: U9.26(SCL)
MCU_SDA: U9.27(SDA)
PWM_0: J8.1 U9.6(LED0)
PWM_1: J9.1 U9.7(LED1)
PWM_2: J10.1 U9.8(LED2)
PWM_3: J11.1 U9.9(LED3)
PWM_4: U9.10(LED4)
PWM_5: U9.11(LED5)
PWM_6: U9.12(LED6)
PWM_7: U9.13(LED7)
PWM_8: U9.15(LED8)
PWM_9: U9.16(LED9)
PWM_10: U9.17(LED10)
PWM_11: U9.18(LED11)
PWM_12: U9.19(LED12)
PWM_13: U9.20(LED13)
PWM_14: U9.21(LED14)
PWM_15: U9.22(LED15)
NetR12_1: R12.1 U9.23(~{OE})

Not connected (* = marked no-connect by the designer): U9 1(A0)* 2(A1)* 3(A2)* 4(A3)* 5(A4)* 24(A5)*

### Library data of the parts
C18 = GCM21BR71E105KA56L: as C3 on sheet [02] - HAB; Supplier 1: Digi-Key; Manufacturer Part Number: GCM21BR71E105KA56L; RoHS: Yes; Category: Ceramic Capacitors; Stock 1: 1572955; Pricing 1: 1=0.33000, 10=0.22500, 100=0.12760, 500=0.09004, 1000=0.07878 (USD); Mount: Surface Mount; Case/Package: 0805; Case Code (Metric): 2012; Case Code (Imperial): 0805; Min Operating Temperature: -55°C; Max Operating Temperature: 125°C; Termination: SMD/SMT; Voltage: 25V; Package Quantity: 3000; Capacitance: 1uF; Voltage Rating: 25V; Tolerance: 10%; Packaging: Tape and Reel; Voltage Rating (DC): 25V; Length: 2mm; Height: 1.25mm; Thickness: 0.055inch; Depth: 1.25mm; Width: 0.049inch; Ratings: AEC-Q200; Radiation Hardening: No; REACH SVHC: No SVHC; Lead Free: Lead Free; ComponentLink1URL: https://datasheet.ciiva.com/3778/359gcm21br71e105ka5623-3778560.pdf?src-supplier=Arrow; ComponentLink1Description: https://datasheet.ciiva.com/3778/359gcm21br71e105ka5623-3778560.pdf?src-supplier=Arrow; ComponentLink2URL: https://datasheet.ciiva.com/16624/product-16624576.pdf?src-supplier=Avnet+Europe; ComponentLink2Description: https://datasheet.ciiva.com/16624/product-16624576.pdf?src-supplier=Avnet+Europe; ComponentLink3URL: https://datasheet.ciiva.com/18183/getdatasheetpartid-153106-18183696.pdf?src-supplier=Verical; ComponentLink3Description: https://datasheet.ciiva.com/18183/getdatasheetpartid-153106-18183696.pdf?src-supplier=Verical; ComponentLink4URL: https://datasheet.ciiva.com/11789/0900766b80ef92d0-11789092.pdf?src-supplier=RSComponents; ComponentLink4Description: https://datasheet.ciiva.com/11789/0900766b80ef92d0-11789092.pdf?src-supplier=RSComponents; ComponentLink5URL: https://datasheet.ciiva.com/137/product-137199.pdf?src-supplier=Digi-Key; ComponentLink5Description: https://datasheet.ciiva.com/137/product-137199.pdf?src-supplier=Digi-Key; ComponentLink6URL: https://datasheet.ciiva.com/137/product-137200.pdf?src-supplier=Digi-Key; ComponentLink6Description: https://datasheet.ciiva.com/137/product-137200.pdf?src-supplier=Digi-Key; ComponentLink7URL: https://datasheet.ciiva.com/137/product-137201.pdf?src-supplier=Digi-Key; ComponentLink7Description: https://datasheet.ciiva.com/137/product-137201.pdf?src-supplier=Digi-Key; ComponentLink8URL: https://datasheet.ciiva.com/2989/product-2989245.pdf?src-supplier=Avnet; ComponentLink8Description: https://datasheet.ciiva.com/2989/product-2989245.pdf?src-supplier=Avnet; ComponentLink9URL: https://datasheet.ciiva.com/2989/product-2989246.pdf?src-supplier=Avnet; ComponentLink9Description: https://datasheet.ciiva.com/2989/product-2989246.pdf?src-supplier=Avnet; Supplier Part Number 1: 490-4785-1-ND
J8-J11 = SM03B-GHS-TB(LF)(SN): JST (JAPAN SOLDERLESS TERMINALS) - SM03B-GHS-TB (LF)(SN) - MACHO, 1,25 MM, 3 VÍAS, SMT, 90 GRADOS; Current Rating: 1A; Voltage Rating (AC): 50V; Gender: Male; Connector Type: Outer Shroud Contact; Number of Positions: 3; Wire/Cable Gauge: 26AWG; Pitch: 0.049inch; Supplier 1: Digi-Key; Manufacturer: JST; Manufacturer Part Number: SM03B-GHS-TB(LF)(SN); RoHS: Yes; Category: Headers and Wire Housings; Stock 1: 8954; Pricing 1: 1=0.49000, 10=0.46500, 100=0.32580, 500=0.27924, 1000=0.23270 (USD); Mount: Surface Mount; Contact Plating: Tin; Contact Material: Bronze; Housing Material: Nylon; Color: Natural; Housing Color: Natural; Min Operating Temperature: -25°C; Max Operating Temperature: 85°C; Number of Rows: 1; Voltage Rating: 50V; Orientation: Right Angle; Packaging: Tape and Reel; Termination: Solder; Fastening Type: Ramp; Number of Contacts: 3; REACH SVHC: No SVHC; Lead Free: Lead Free; ComponentLink1URL: https://datasheet.ciiva.com/25617/0900766b810cef18-25617270.pdf?src-supplier=RSComponents; ComponentLink1Description: https://datasheet.ciiva.com/25617/0900766b810cef18-25617270.pdf?src-supplier=RSComponents; ComponentLink2URL: https://datasheet.ciiva.com/16379/jstsm03b-ghs-tb-lf-sn-16379590.pdf?src-supplier=Future+Electronics; ComponentLink2Description: https://datasheet.ciiva.com/16379/jstsm03b-ghs-tb-lf-sn-16379590.pdf?src-supplier=Future+Electronics; ComponentLink3URL: https://datasheet.ciiva.com/8052/5438-8052261.pdf?src-supplier=Element14; ComponentLink3Description: https://datasheet.ciiva.com/8052/5438-8052261.pdf?src-supplier=Element14; Supplier Part Number 1: 455-1565-1-ND
R12 = ERJ-P06F1002V: as R1 on sheet [02] - HAB; Supplier 1: Digi-Key; Manufacturer Part Number: ERJ-P06F1002V; RoHS: Yes; Category: Chip SMD Resistors; Stock 1: 119213; Pricing 1: 1=0.17000, 10=0.14800, 100=0.05770, 1000=0.02416, 2500=0.02214 (USD); Mount: Surface Mount; Case/Package: 0805; Case Code (Imperial): 0805; Case Code (Metric): 2012; Contact Plating: Tin; Min Operating Temperature: -55°C; Max Operating Temperature: 155°C; Resistance: 10kR; Packaging: Tape and Reel; Tolerance: 1%; Package Quantity: 5000; Termination: SMD/SMT; Military Standard: Not; Voltage Rating (DC): 150V; Composition: Thick Film; Length: 2mm; Height: 0.6mm; Width: 1.2mm; Depth: 1.25mm; Radiation Hardening: No; REACH SVHC: No SVHC; Lead Free: Lead Free; ComponentLink1URL: https://datasheet.ciiva.com/11811/0900766b812cb812-11811124.pdf?src-supplier=RSComponents; ComponentLink1Description: https://datasheet.ciiva.com/11811/0900766b812cb812-11811124.pdf?src-supplier=RSComponents; ComponentLink2URL: https://datasheet.ciiva.com/24069/aoa0000ce4-64075-24069191.pdf?src-supplier=Mouser; ComponentLink2Description: https://datasheet.ciiva.com/24069/aoa0000ce4-64075-24069191.pdf?src-supplier=Mouser; ComponentLink3URL: https://datasheet.ciiva.com/48426/erjp-series-eng-tds-48426779.pdf?src-supplier=Distrelec; ComponentLink3Description: https://datasheet.ciiva.com/48426/erjp-series-eng-tds-48426779.pdf?src-supplier=Distrelec; Supplier Part Number 1: P16059CT-ND
U9 = CMP-10140-000001-1: IC LED DRIVER RGBA 28-TSSOP; Manufacturer: NXP Semiconductors; Max Power Dissipation: 400mW; Dimming: I2C,PWM; Number Of Outputs: 16; Import Ts: 1521846855; Min Supply Voltage: 2.3V; Max Supply Voltage: 5.5V; Output Voltage: 5V; Nominal Supply Current: 6mA; Standoff Height: 0.05mm; Output Current: 25mA; Ciiva Ids: 1426473; Temperature Range Low: -40°C; Footprint Url: https://www.nxp.com/docs/en/package-information/SOT361-1.pdf; Height: 1.1mm; Manufacturer Part Number: PCA9685PW,118; Device Class L2: Power Management ICs; Temperature: -40°C to +85°C; Temperature Range High: +85°C; Digikey Description: IC LED DRIVER RGBA 28-TSSOP; ComponentLink2Description: Datasheet; Device Class L3: LED Drivers; Ambient Temperature Range Low: -40°C; ComponentLink2URL: https://www.nxp.com/docs/en/data-sheet/PCA9685.pdf; Ambient Temperature Range High: +85°C; Device Class L1: Integrated Circuits (ICs); Mouser Description: LED Display Drivers I2C Bus LED Controller 28-Pin; Octopart: https://octopart.com/pca9685pw%2C118-nxp+semiconductors-11853435; Release Date: 1454319143; Lead Free: Yes; Category: IC; RoHS: TRUE; Package: SOT361-1; Automotive: No